# EAGLE design WaldoRevB (EAGLE 7.6.0)
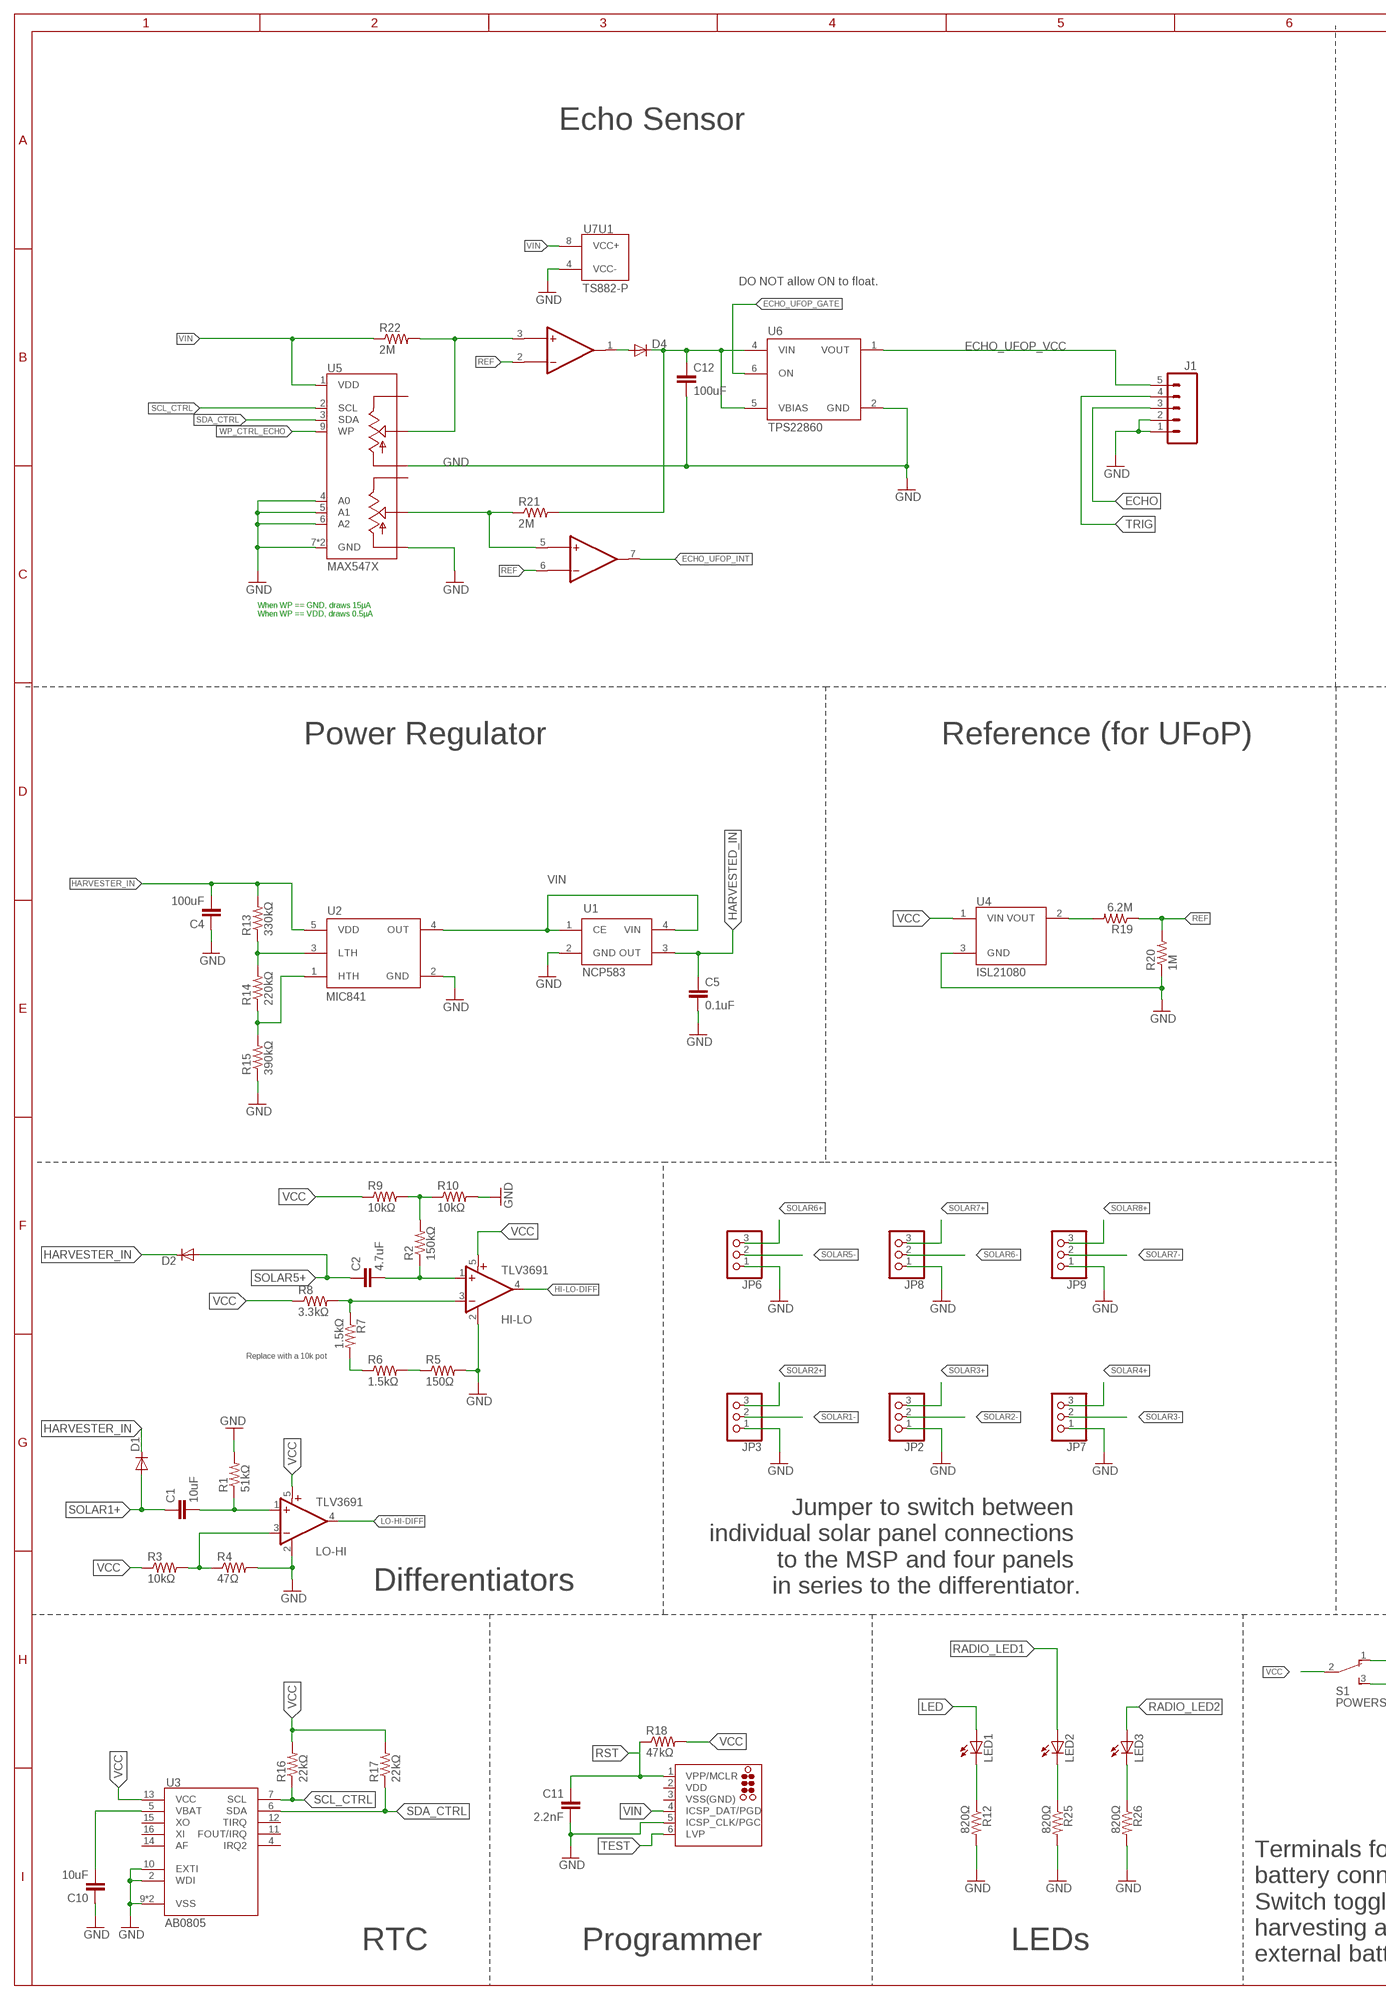
[diagram p0: schematic, sheet 1, part 1 of 2]
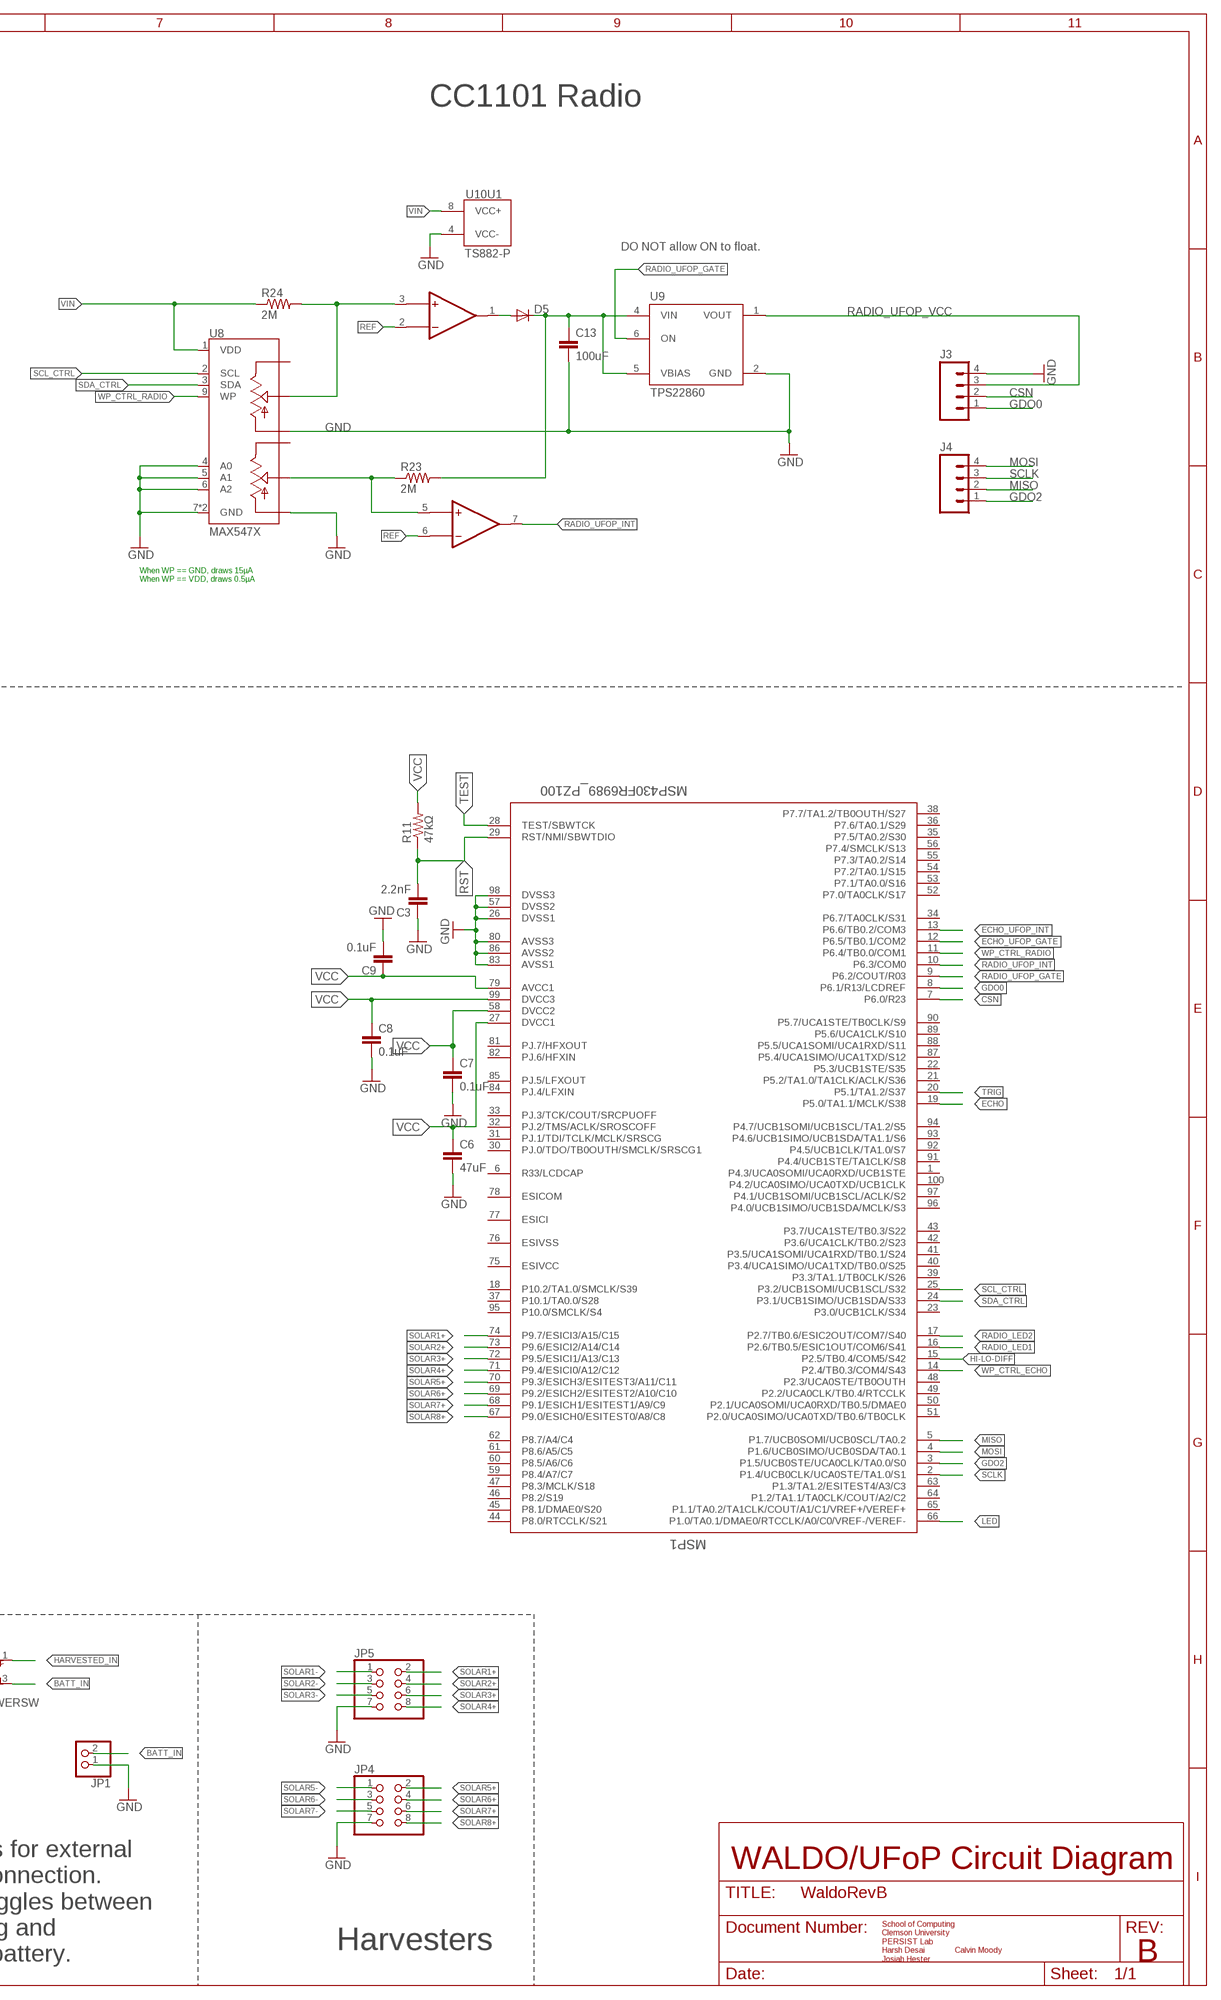
[diagram p1: schematic, sheet 1, part 2 of 2]

## Parts
C1  10uF  CAP0805  [0805]
C2  4.7uF  CAP0805  [0805]
C3  2.2nF  CAP0805  [0805]
C4  100uF  CAP0805  [0805]
C5  0.1uF  CAP0805  [0805]
C6  47uF  CAP0805  [0805]
C7  0.1uF  CAP0805  [0805]
C8  0.1uF  CAP0805  [0805]
C9  0.1uF  CAP0805  [0805]
C10  10uF  CAP0805  [0805]
C11  2.2nF  CAP0805  [0805]
C12  100uF  CAP1210  [1210]
C13  100uF  CAP1210  [1210]
D1  DIODESOD523  [SOD523]
D2  DIODESOD523  [SOD523]
D4  DIODESOD  [SOD-323]
D5  DIODESOD  [SOD-323]
HI-LO  TLV3691  [SC70-5]
J1  M05PTH  [1X05]
J2  TC2030-MCP-NL  [TC2030-MCP-NL]
J3  M04PTH  [1X04]
J4  M04PTH  [1X04]
JP1  PINHD-1X2  [1X02]
JP2  PINHD-1X3  [1X03]
JP3  PINHD-1X3  [1X03]
JP4  PINHD-2X4  [2X04]
JP5  PINHD-2X4  [2X04]
JP6  PINHD-1X3  [1X03]
JP7  PINHD-1X3  [1X03]
JP8  PINHD-1X3  [1X03]
JP9  PINHD-1X3  [1X03]
LED1  LEDCHIP-LED0805  [CHIP-LED0805]
LED2  LEDCHIP-LED0805  [CHIP-LED0805]
LED3  LEDCHIP-LED0805  [CHIP-LED0805]
LO-HI  TLV3691  [SC70-5]
MSP1  MSP430FR6989_PZ100  [PZ100]
R1  51kΩ  R-US_M0805  [M0805]
R2  150kΩ  R-US_M0805  [M0805]
R3  10kΩ  R-US_M0805  [M0805]
R4  47Ω  R-US_M0805  [M0805]
R5  150Ω  R-US_M0805  [M0805]
R6  1.5kΩ  R-US_M0805  [M0805]
R7  1.5kΩ  R-US_M0805  [M0805]
R8  3.3kΩ  R-US_M0805  [M0805]
R9  10kΩ  R-US_M0805  [M0805]
R10  10kΩ  R-US_M0805  [M0805]
R11  47kΩ  R-US_M0805  [M0805]
R12  820Ω  R-US_M0805  [M0805]
R13  330kΩ  R-US_M0805  [M0805]
R14  220kΩ  R-US_M0805  [M0805]
R15  390kΩ  R-US_M0805  [M0805]
R16  22kΩ  R-US_M0805  [M0805]
R17  22kΩ  R-US_M0805  [M0805]
R18  47kΩ  R-US_M0805  [M0805]
R19  6.2M  R-EU0603  [0603]
R20  1M  R-EU0603  [0603]
R21  2M  R-EU0603  [0603]
R22  2M  R-EU0603  [0603]
R23  2M  R-EU0603  [0603]
R24  2M  R-EU0603  [0603]
R25  820Ω  R-US_M0805  [M0805]
R26  820Ω  R-US_M0805  [M0805]
S1  POWERSW  [TL3XYO]
U1  NCP583  [SC82-AB_1PRIMARY]
U2  MIC841  [SC70-5]
U3  AB0805  [QFN16]
U4  ISL21080  [SOT-23]
U5  MAX547X  [QFN16]
U6  TPS22860  [TSOT23-6]
U7  TS882-P  [UDFN8]
U8  MAX547X  [QFN16]
U9  TPS22860  [TSOT23-6]
U10  TS882-P  [UDFN8]

## Nets
BATT_IN: JP1.2 S1.3(S)
CSN: J3.2 MSP1.7(P6.0/R23)
ECHO: J1.3 MSP1.19(P5.0/TA1.1/MCLK/S38)
ECHO_UFOP_GATE: MSP1.12(P6.5/TB0.1/COM2) U6.6(ON)
ECHO_UFOP_INT: MSP1.13(P6.6/TB0.2/COM3) U7.7(OP2:OUT1)
ECHO_UFOP_VCC: J1.5 U6.1(VOUT)
GDO0: J3.1 MSP1.8(P6.1/R13/LCDREF)
GDO2: J4.1 MSP1.3(P1.5/UCB0STE/UCA0CLK/TA0.0/S0)
GND: C3.1 C4.1 C5.2 C6.2 C7.2 C8.2 C9.2 C10.1 C11.2 C12.2 C13.2 HI-LO.2(GND) J1.1 J1.2 J2.5(ICSP_CLK/PGC) J3.4 JP1.1 JP2.1 JP3.1 JP4.7 JP5.7 JP6.1 JP7.1 JP8.1 JP9.1 LO-HI.2(GND) MSP1.26(DVSS1) MSP1.57(DVSS2) MSP1.80(AVSS3) MSP1.83(AVSS1) MSP1.86(AVSS2) MSP1.98(DVSS3) R1.2 R4.2 R5.2 R10.2 R12.2 R15.1 R20.1 R25.2 R26.2 U1.2(GND) U2.2(GND) U3.2(WDI) U3.9(VSS) U3.10(EXTI) U3.TH(VSS) U4.3(GND) U5.4(A0) U5.5(A1) U5.6(A2) U5.7(GND) U5.10(LB) U5.13(LA) U5.TH(GND) U6.2(GND) U7.4(U1:VCC-) U8.4(A0) U8.5(A1) U8.6(A2) U8.7(GND) U8.10(LB) U8.13(LA) U8.TH(GND) U9.2(GND) U10.4(U1:VCC-)
HARVESTED_IN: C5.1 S1.1(O) U1.3(OUT)
HARVESTER_IN: C4.2 D1.C D2.C R13.2 U2.5(VDD)
HI-LO-DIFF: HI-LO.4(OUT) MSP1.15(P2.5/TB0.4/COM5/S42)
LED: LED1.A MSP1.66(P1.0/TA0.1/DMAE0/RTCCLK/A0/C0/VREF-/VEREF-)
LO-HI-DIFF: LO-HI.4(OUT)
MISO: J4.2 MSP1.5(P1.7/UCB0SOMI/UCB0SCL/TA0.2)
MOSI: J4.4 MSP1.4(P1.6/UCB0SIMO/UCB0SDA/TA0.1)
N$1: C1.2 LO-HI.1(+IN) R1.1
N$2: C2.2 HI-LO.1(+IN) R2.1
N$3: LO-HI.3(-IN) R3.2 R4.1
N$4: R5.1 R6.2
N$5: R6.1 R7.2
N$6: HI-LO.3(-IN) R7.1 R8.2
N$7: LED1.C R12.1
N$8: R2.2 R9.2 R10.1
N$9: LED2.C R25.1
N$10: LED3.C R26.1
N$11: R13.1 R14.2 U2.3(LTH)
N$12: R14.1 R15.2 U2.1(HTH)
N$13: C10.2 U3.5(VBAT)
N$14: R19.2 U4.2(VOUT)
N$16: R22.2 U5.14(WA) U7.3(OP1:IN1+)
N$17: C12.1 D4.1(C) R21.2 U6.4(VIN) U6.5(VBIAS)
N$18: R21.1 U5.11(WB) U7.5(OP2:IN1+)
N$20: D4.2(A) U7.1(OP1:OUT1)
N$21: R24.2 U8.14(WA) U10.3(OP1:IN1+)
N$22: C13.1 D5.1(C) R23.2 U9.4(VIN) U9.5(VBIAS)
N$23: R23.1 U8.11(WB) U10.5(OP2:IN1+)
N$24: D5.2(A) U10.1(OP1:OUT1)
RADIO_LED1: LED2.A MSP1.16(P2.6/TB0.5/ESIC1OUT/COM6/S41)
RADIO_LED2: LED3.A MSP1.17(P2.7/TB0.6/ESIC2OUT/COM7/S40)
RADIO_UFOP_GATE: MSP1.9(P6.2/COUT/R03) U9.6(ON)
RADIO_UFOP_INT: MSP1.10(P6.3/COM0) U10.7(OP2:OUT1)
RADIO_UFOP_VCC: J3.3 U9.1(VOUT)
REF: R19.1 R20.2 U7.2(OP1:IN1-) U7.6(OP2:IN1-) U10.2(OP1:IN1-) U10.6(OP2:IN1-)
RST: C3.2 C11.1 J2.1(VPP/MCLR) MSP1.29(RST/NMI/SBWTDIO) R11.1 R18.1
SCL_CTRL: MSP1.25(P3.2/UCB1SOMI/UCB1SCL/S32) R16.1 U3.7(SCL) U5.2(SCL) U8.2(SCL)
SCLK: J4.3 MSP1.2(P1.4/UCB0CLK/UCA0STE/TA1.0/S1)
SDA_CTRL: MSP1.24(P3.1/UCB1SIMO/UCB1SDA/S33) R17.1 U3.6(SDA) U5.3(SDA) U8.3(SDA)
SOLAR1+: C1.1 D1.A JP5.2 MSP1.74(P9.7/ESICI3/A15/C15)
SOLAR1-: JP3.2 JP5.1
SOLAR2+: JP3.3 JP5.4 MSP1.73(P9.6/ESICI2/A14/C14)
SOLAR2-: JP2.2 JP5.3
SOLAR3+: JP2.3 JP5.6 MSP1.72(P9.5/ESICI1/A13/C13)
SOLAR3-: JP5.5 JP7.2
SOLAR4+: JP5.8 JP7.3 MSP1.71(P9.4/ESICI0/A12/C12)
SOLAR5+: C2.1 D2.A JP4.2 MSP1.70(P9.3/ESICH3/ESITEST3/A11/C11)
SOLAR5-: JP4.1 JP6.2
SOLAR6+: JP4.4 JP6.3 MSP1.69(P9.2/ESICH2/ESITEST2/A10/C10)
SOLAR6-: JP4.3 JP8.2
SOLAR7+: JP4.6 JP8.3 MSP1.68(P9.1/ESICH1/ESITEST1/A9/C9)
SOLAR7-: JP4.5 JP9.2
SOLAR8+: JP4.8 JP9.3 MSP1.67(P9.0/ESICH0/ESITEST0/A8/C8)
TEST: J2.6(LVP) MSP1.28(TEST/SBWTCK)
TRIG: J1.4 MSP1.20(P5.1/TA1.2/S37)
VCC: C6.1 C7.1 C8.1 C9.1 HI-LO.5(V+) LO-HI.5(V+) MSP1.27(DVCC1) MSP1.58(DVCC2) MSP1.79(AVCC1) MSP1.99(DVCC3) R3.1 R8.1 R9.1 R11.2 R16.2 R17.2 R18.2 S1.2(P) U3.13(VCC) U4.1(VIN)
VIN: J2.4(ICSP_DAT/PGD) R22.1 R24.1 U1.1(CE) U1.4(VIN) U2.4(OUT) U5.1(VDD) U7.8(U1:VCC+) U8.1(VDD) U10.8(U1:VCC+)
WP_CTRL_ECHO: MSP1.14(P2.4/TB0.3/COM4/S43) U5.9(WP)
WP_CTRL_RADIO: MSP1.11(P6.4/TB0.0/COM1) U8.9(WP)
Unconnected: MSP1.1(P4.3/UCA0SOMI/UCA0RXD/UCB1STE) MSP1.6(R33/LCDCAP) MSP1.18(P10.2/TA1.0/SMCLK/S39) MSP1.21(P5.2/TA1.0/TA1CLK/ACLK/S36) MSP1.22(P5.3/UCB1STE/S35) MSP1.23(P3.0/UCB1CLK/S34) MSP1.30(PJ.0/TDO/TB0OUTH/SMCLK/SRSCG1) MSP1.31(PJ.1/TDI/TCLK/MCLK/SRSCG) MSP1.32(PJ.2/TMS/ACLK/SROSCOFF) MSP1.33(PJ.3/TCK/COUT/SRCPUOFF) MSP1.34(P6.7/TA0CLK/S31) MSP1.35(P7.5/TA0.2/S30) MSP1.36(P7.6/TA0.1/S29) MSP1.37(P10.1/TA0.0/S28) MSP1.38(P7.7/TA1.2/TB0OUTH/S27) MSP1.39(P3.3/TA1.1/TB0CLK/S26) MSP1.40(P3.4/UCA1SIMO/UCA1TXD/TB0.0/S25) MSP1.41(P3.5/UCA1SOMI/UCA1RXD/TB0.1/S24) MSP1.42(P3.6/UCA1CLK/TB0.2/S23) MSP1.43(P3.7/UCA1STE/TB0.3/S22) MSP1.44(P8.0/RTCCLK/S21) MSP1.45(P8.1/DMAE0/S20) MSP1.46(P8.2/S19) MSP1.47(P8.3/MCLK/S18) MSP1.48(P2.3/UCA0STE/TB0OUTH) MSP1.49(P2.2/UCA0CLK/TB0.4/RTCCLK) MSP1.50(P2.1/UCA0SOMI/UCA0RXD/TB0.5/DMAE0) MSP1.51(P2.0/UCA0SIMO/UCA0TXD/TB0.6/TB0CLK) MSP1.52(P7.0/TA0CLK/S17) MSP1.53(P7.1/TA0.0/S16) MSP1.54(P7.2/TA0.1/S15) MSP1.55(P7.3/TA0.2/S14) MSP1.56(P7.4/SMCLK/S13) MSP1.59(P8.4/A7/C7) MSP1.60(P8.5/A6/C6) MSP1.61(P8.6/A5/C5) MSP1.62(P8.7/A4/C4) MSP1.63(P1.3/TA1.2/ESITEST4/A3/C3) MSP1.64(P1.2/TA1.1/TA0CLK/COUT/A2/C2) MSP1.65(P1.1/TA0.2/TA1CLK/COUT/A1/C1/VREF+/VEREF+) MSP1.75(ESIVCC) MSP1.76(ESIVSS) MSP1.77(ESICI) MSP1.78(ESICOM) MSP1.81(PJ.7/HFXOUT) MSP1.82(PJ.6/HFXIN) MSP1.84(PJ.4/LFXIN) MSP1.85(PJ.5/LFXOUT) MSP1.87(P5.4/UCA1SIMO/UCA1TXD/S12) MSP1.88(P5.5/UCA1SOMI/UCA1RXD/S11) MSP1.89(P5.6/UCA1CLK/S10) MSP1.90(P5.7/UCA1STE/TB0CLK/S9) MSP1.91(P4.4/UCB1STE/TA1CLK/S8) MSP1.92(P4.5/UCB1CLK/TA1.0/S7) MSP1.93(P4.6/UCB1SIMO/UCB1SDA/TA1.1/S6) MSP1.94(P4.7/UCB1SOMI/UCB1SCL/TA1.2/S5) MSP1.95(P10.0/SMCLK/S4) MSP1.96(P4.0/UCB1SIMO/UCB1SDA/MCLK/S3) MSP1.97(P4.1/UCB1SOMI/UCB1SCL/ACLK/S2) MSP1.100(P4.2/UCA0SIMO/UCA0TXD/UCB1CLK) U3.4(IRQ2) U3.11(FOUT/IRQ) U3.12(TIRQ) U3.14(AF) U3.15(XO) U3.16(XI) U5.12(HB) U5.15(HA) U8.12(HB) U8.15(HA)

## Notes on the sheet
- CC1101 Radio
- Echo Sensor
- DO NOT allow ON to float.
- DO NOT allow ON to float.
- When WP == GND, draws 15µA
  When WP == VDD, draws 0.5µA
- When WP == GND, draws 15µA
  When WP == VDD, draws 0.5µA
- Power Regulator | Reference (for UFoP)
- Replace with a 10k pot
- Jumper to switch between 
  individual solar panel connections 
  to the MSP and four panels 
  in series to the differentiator.
- Differentiators
- WALDO/UFoP Circuit Diagram
- RTC | Programmer | LEDs | Harvesters
- Terminals for external
  battery connection.
  Switch toggles between
  harvesting and 
  external battery.
- School of Computing
  Clemson University
  PERSIST Lab
  Harsh Desai               Calvin Moody
  Josiah Hester
- B

## Power pins joined to a net without a drawn wire
VDD: J2.2(VDD)
VSS(GND): J2.3(VSS(GND))

## Library data of the parts
C1-C11 = SparkFun-Capacitors:CAP: Capacitor Standard 0603 ceramic capacitor, and 0.1" leaded capacitor.
C12 C13 = SparkFun-Capacitors:CAP: Capacitor Standard 0603 ceramic capacitor, and 0.1" leaded capacitor.; DIGIKEY: 490-9969-1-ND
D1 D2 = SparkFun-DiscreteSemi:DIODE: Diode These are standard reverse protection diodes and small signal diodes. SMA package can handle up to about 1A. SOD-323 can handle about 200mA. What the SOD-323 package when ordering, there are some mfgs out there that are 5-pin packages.
D4 D5 = SparkFun-DiscreteSemi:DIODE: Diode These are standard reverse protection diodes and small signal diodes. SMA package can handle up to about 1A. SOD-323 can handle about 200mA. What the SOD-323 package when ordering, there are some mfgs out there that are 5-pin packages.; PROD_ID: DIO-09646
HI-LO LO-HI = fedpower:TLV3691: 0.9-V to 6.5-V, Nanopower Comparator Datasheets Analog Signal Chain Guide <http://www.ti.com/lit/pdf/slyb174> TLV3691 <http://www.ti.com/lit/ds/symlink/tlv3691.pdf> Manufacturer Product Page TLV3691IDPFR Specifications <http://www.ti.com/general/docs/suppproductinfo.tsp?distId=10&orderablePartNumber=TLV3691IDPFR> Standard Package <javascript:dlgHelp('Standard%20Packaging%20Help');> 1 Category Integrated Circuits (ICs) </product-search/en/integrated-circuits-ics> Family Linear - Comparators </product-search/en/integrated-circuits-ics/linear-comparators/2556221> Series - Packaging <javascript:dlgHelp('Standard%20Packaging%20Help');> Cut Tape (CT) <javascript:dlgHelp('Cut%20Tape%20Help');> Type General Purpose Number of Elements 1 Output Type Push-Pull Voltage - Supply, Single/Dual (±) 0.9 V ~ 6.5 V, ±0.45 V ~ 3.25 V Voltage - Input Offset (Max) 3mV Current - Input Bias (Max) 100pA Current - Output (Typ) 42mA Current - Quiescent (Max) 150nA CMRR, PSRR (Typ) - Propagation Delay (Max) 35µs Hysteresis - Operating Temperature -40°C ~ 125°C Package / Case 6-XFDFN Mounting Type Surface Mount Supplier Device Package 6-X2SON (1x1) Online Catalog Comparators - 1 element </catalog/en/partgroup/comparators-1-element/3112?mpart=TLV3691IDPFR&vendor=296&WT.z_ref_page_type=PS&WT.z_ref_page_sub_type=PD&WT.z_ref_page_id=PD&WT.z_ref_page_event=DC_Link_Table> Other Names 296-37242-1
J1 = SparkFun-Connectors:M05: Header 5 Standard 5-pin 0.1" header. Use with straight break away headers (SKU : PRT-00116), right angle break away headers (PRT-00553), swiss pins (PRT-00743), machine pins (PRT-00117), and female headers (PRT-00115). Molex polarized connector foot print use with SKU : PRT-08230 with associated crimp pins and housings.
J2 = tag-connect_msp430:TC2030: TAG-CONNECT ICSP Connector Manufacturer: Tag-Connect <http://www.tag-connect.com> Cable for easy In-Circuit Serial Programming. Designed for Microchip ICD2, suitable for many others. Two variants - one "with legs" (for hands-free fit on PCB) and another "without legs" for quick programming. PAD Description 1 MCLR/Vpp 2 Vdd 3 GND 4 PGD (ISPDAT) 5 PGC (ISPCLK) 6 nc (used for LVP) ©2009 ROFA.cz - modified and updated by Robert Darlington ‹rdarlington@gmail.com›
J3 J4 = SparkFun-Connectors:M04: Header 4 Standard 4-pin 0.1" header. Use with straight break away headers (SKU : PRT-00116), right angle break away headers (PRT-00553), swiss pins (PRT-00743), machine pins (PRT-00117), and female headers (PRT-00115). Molex polarized connector foot print use with SKU : PRT-08231 with associated crimp pins and housings. 1MM SMD Version SKU: PRT-10208; PROD_ID: CONN-09696
JP1 = pinhead:PINHD-1X2: PIN HEADER
JP2 JP3 JP6-JP9 = pinhead:PINHD-1X3: PIN HEADER
JP4 JP5 = pinhead:PINHD-2X4: PIN HEADER
LED1-LED3 = led:LED: LED OSRAM: - CHIPLED LG R971, LG N971, LY N971, LG Q971, LY Q971, LO R971, LY R971 LH N974, LH R974 LS Q976, LO Q976, LY Q976 LO Q996 - Hyper CHIPLED LW Q18S LB Q993, LB Q99A, LB R99A - SideLED LS A670, LO A670, LY A670, LG A670, LP A670 LB A673, LV A673, LT A673, LW A673 LH A674 LY A675 LS A676, LA A676, LO A676, LY A676, LW A676 LS A679, LY A679, LG A679 - Hyper Micro SIDELED® LS Y876, LA Y876, LO Y876, LY Y876 LT Y87S - SmartLED LW L88C, LW L88S LB L89C, LB L89S, LG L890 LS L89K, LO L89K, LY L89K LS L896, LA L896, LO L896, LY L896 - TOPLED LS T670, LO T670, LY T670, LG T670, LP T670 LSG T670, LSP T670, LSY T670, LOP T670, LYG T670 LG T671, LOG T671, LSG T671 LB T673, LV T673, LT T673, LW T673 LH T674 LS T676, LA T676, LO T676, LY T676, LB T676, LH T676, LSB T676, LW T676 LB T67C, LV T67C, LT T67C, LS T67K, LO T67K, LY T67K, LW E67C LS E67B, LA E67B, LO E67B, LY E67B, LB E67C, LV E67C, LT E67C LW T67C LS T679, LY T679, LG T679 LS T770, LO T770, LY T770, LG T770, LP T770 LB T773, LV T773, LT T773, LW T773 LH T774 LS E675, LA E675, LY E675, LS T675 LS T776, LA T776, LO T776, LY T776, LB T776 LHGB T686 LT T68C, LB T68C - Hyper Mini TOPLED® LB M676 - Mini TOPLED Santana® LG M470 LS M47K, LO M47K, LY M47K Source: http://www.osram.convergy.de LUXEON: - LUMILED® LXK2-PW12-R00, LXK2-PW12-S00, LXK2-PW14-U00, LXK2-PW14-V00 LXK2-PM12-R00, LXK2-PM12-S00, LXK2-PM14-U00 LXK2-PE12-Q00, LXK2-PE12-R00, LXK2-PE12-S00, LXK2-PE14-T00, LXK2-PE14-U00 LXK2-PB12-K00, LXK2-PB12-L00, LXK2-PB12-M00, LXK2-PB14-N00, LXK2-PB14-P00, LXK2-PB14-Q00 LXK2-PR12-L00, LXK2-PR12-M00, LXK2-PR14-Q00, LXK2-PR14-R00 LXK2-PD12-Q00, LXK2-PD12-R00, LXK2-PD12-S00 LXK2-PH12-R00, LXK2-PH12-S00 LXK2-PL12-P00, LXK2-PL12-Q00, LXK2-PL12-R00 Source: www.luxeon.com KINGBRIGHT: KA-3528ASYC Source: www.kingbright.com
MSP1 = msp430:MSP430FR6989_PZ100
R1-R18 R25 R26 = resistor:R-US_: RESISTOR, American symbol
R19 = tiny_passives:R-EU; DIGIKEY: 541-6.20MHCT-ND
R20 = tiny_passives:R-EU; DIGIKEY: 311-1.00MHRCT-ND
R21 R23 = tiny_passives:R-EU; DIGIKEY: 311-2.00MHRCT-ND
R22 R24 = tiny_passives:R-EU
S1 = GreenBoard:POWERSW: TINY SWITCH ON - ON Source: http://www2.produktinfo.conrad.com/datenblaetter/700000-724999/705152-da-01-de-Subminiaturschalter_TL_36YO.pdf
U1 = ncp583:NCP583: NCP583 - Ultra-Low Iq 150 mA CMOS LDO Regulator with Enable The NCP583 series of low dropout regulators are designed for portable battery powered applications which require precise output voltage accuracy and low quiescent current. These devices feature an enable function which lowers current consumption significantly and are offered in two small packages; SC−82AB and the SOT−563. A 1.0 mF ceramic capacitor is the recommended value to be used with these devices on the output pin.
U2 = mic841:MIC841: MIC841:Comparator with reference and adj. hysteresis
U3 = AB08XX:AB0805: AB08X5 Real-Time Clock Family: I2C Version The ABRACON AB08X5 Real-Time Clock family provides a groundbreaking combination of ultra-low power coupled with a highly sophisticated feature set. With power requirements significantly lower than any other industry RTC (as low as 14 nA), these are the first semiconductors based on innovative SPOTTM (Subthreshold Power Optimized Technology) CMOS platform. The AB08X5 includes on-chip oscillators to provide minimum power consumption, full RTC functions including battery backup and programmable counters and alarms for timer and watchdog functions, and either an I2C or SPI serial interface for communication with a host controller.; MOUSER: 815-AB0805-T3
U4 = isl21080:ISL21080: Intersil: ISL21080, 300nA NanoPower Voltage References The ISL21080 analog voltage references feature low supply voltage operation at ultra-low 310nA typ, 1.5µA max operating current. Additionally, the ISL21080 family features guaranteed initial accuracy as low as ±0.2% and 50ppm/°C temperature coefficient. These references are ideal for general purpose portable applications to extend battery life at lower cost. The ISL21080 is provided in the industry standard 3 Ld SOT-23 pinout. The ISL21080 output voltages can be used as precision voltage sources for voltage monitors, control loops, standby voltages for low power states for DSP, FPGA, Datapath Controllers, microcontrollers and other core voltages: 0.9V, 1.024V, 1.25V, 1.5V, 2.048V, 2.5V, 3.0V, 3.3V, 4.096V and 5.0V. Special Note: Post-assembly x-ray inspection may lead to permanent changes in device output voltage and should be minimized or avoided. For further information, please see “Applications Information” on page 14 and AN1533, “X-Ray Effects on Intersil FGA References”.; DIGIKEY: ISL21080DIH309Z-TKCT-ND
U5 U8 = max547x:MAX547X: MAXIM MAX547X: Dual, 256-Tap, Nonvolatile, I2C-Interface, Digital Potentiometers, 400nA Iq, 250µA 12ms write The MAX5477/MAX5478/MAX5479 nonvolatile, dual, linear-taper, digital potentiometers perform the function of a mechanical potentiometer, but replace the mechanics with a simple 2-wire digital interface. Each device performs the same function as a discrete potentiometer or variable resistor and has 256 tap points. The devices feature an internal, nonvolatile EEPROM used to store the wiper position for initialization during power-up. A write-protect feature prevents accidental overwrites of the EEPROM. The fast-mode I2C-compatible serial interface allows communication at data rates up to 400kbps, minimizing board space and reducing interconnection complexity in many applications. Three address inputs allow a total of eight unique address combinations.; DIGIKEY: MAX5479ETE+-ND
U6 U9 = tps22860:TPS22860: TI: TPS22860 Ultra-Low Leakage Load Switch The TPS22860 is a small, ultra-low leakage current, single channel load switch. The device requires a VBIAS voltage and can operate over an input voltage range of 0 V to VBIAS. It can support a maximum continuous current of 200 mA. The switch is controlled by an on/off input (ON), which is capable of interfacing directly with low-voltage control signals. The TPS22860 is available in two small, space-saving 6-pin SOT-23 and SC70 packages. The device is characterized for operation over the free-air temperature range of –40°C to 85°C.; DIGIKEY: 296-43982-1-ND
U7 U10 = ts882:TS882-P; DIGIKEY: 497-14073-1-ND

## Board
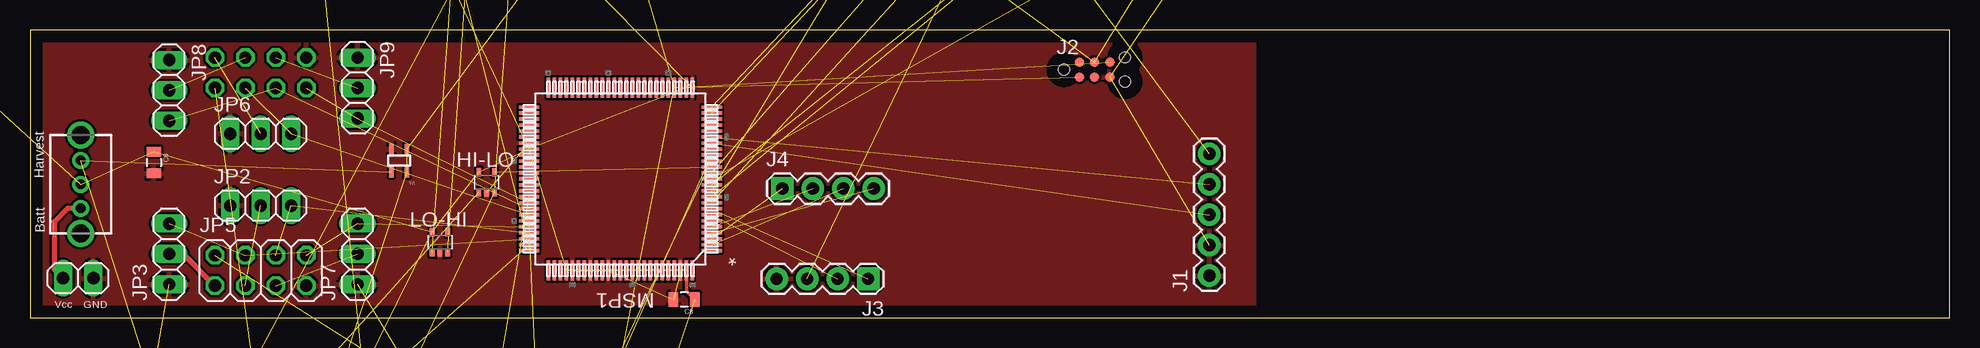
[diagram p2: board, top side]
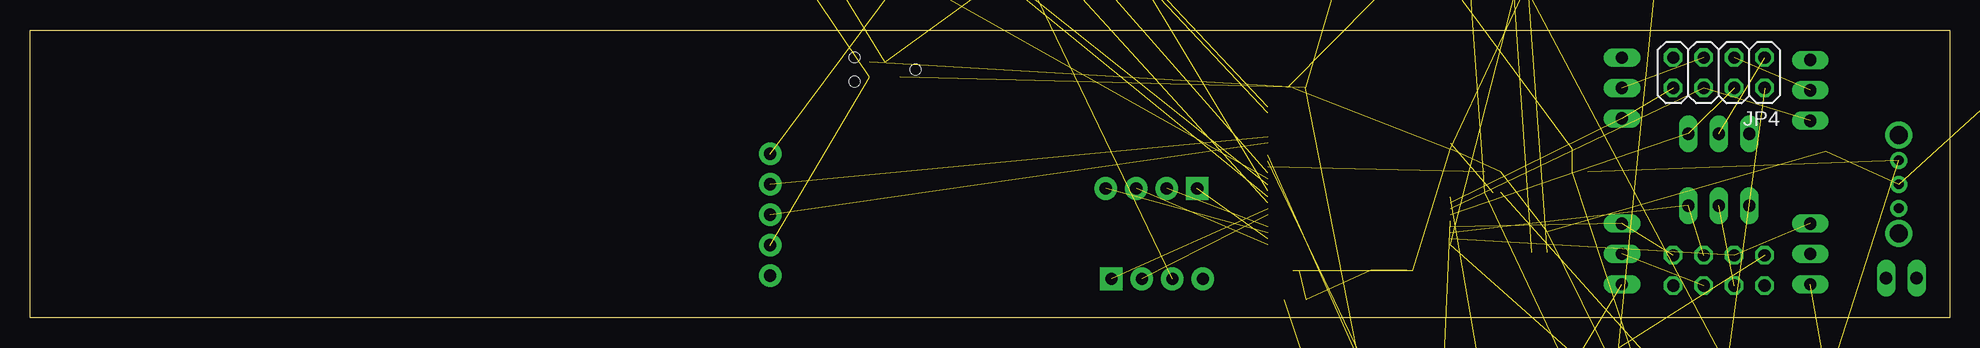
[diagram p3: board, bottom side, seen from below]

Size 160 x 24 mm. Coordinates in mm from the lower left corner, seen from the top.
Outline: 0,0 160,0 160,24 0,24 0,0
Copper layers (1*16): Top 0.035mm / dielectric 1.5mm / Bottom 0.035mm
Design rules "default": minimum track width 10mil, minimum drill 24mil, track to track 8mil, track to pad 8mil, pad to pad 8mil, via to via 8mil, smd to smd 8mil, copper to edge 40mil, drill to drill 8mil, minimum pad ring 10mil, minimum via ring 8mil, stop-mask expansion 4mil, vias tented up to drill 0mil, thermal gap 10mil

### Footprints (pad centres in the part's own frame; a part is rotated, then mirrored left to right if it is on the bottom)
0805 = smd 0.8 x 1.2: 1 -0.9,0; 2 0.9,0
1210 = smd 1.2 x 2: 1 -1.6,0; 2 1.6,0
SOD523 = smd 0.7 x 0.5: A 0.7,0; C -0.6,0
SOD-323 = smd 0.63 x 0.83: 1 -1.15,0; 2 1.15,0
SC70-5 = smd 0.4 x 0.7: 1 -0.65,-0.85; 2 0,-0.85; 3 0.65,-0.85; 4 0.65,0.85; 5 -0.65,0.85
1X05 = drill 1.016 pad 1.88: 1 0,0; 2 2.54,0; 3 5.08,0; 4 7.62,0; 5 10.16,0
TC2030-MCP-NL = smd 0.787 x 0.787: 1 1.27,-0.635; 2 1.27,0.635; 3 2.54,-0.635; 4 2.54,0.635; 5 3.81,-0.635; 6 3.81,0.635 | hole 0.889: 0,0; 5.08,-1.016; 5.08,1.016
1X04 = drill 1.016 pad 1.88 square: 1 0,0 | drill 1.016 pad 1.88: 2 2.54,0; 3 5.08,0; 4 7.62,0
1X02 = drill 1.016 long: 1 -1.27,0; 2 1.27,0
1X03 = drill 1.016 long: 1 -2.54,0; 2 0,0; 3 2.54,0
2X04 = drill 1.016 octagon: 1 -3.81,-1.27; 2 -3.81,1.27; 3 -1.27,-1.27; 4 -1.27,1.27; 5 1.27,-1.27; 6 1.27,1.27; 7 3.81,-1.27; 8 3.81,1.27
CHIP-LED0805 = smd 1.2 x 1.2: A 0,-1.05; C 0,1.05
PZ100 = smd 1.676 x 0.279: 1 -7.62,5.994; 2 -7.62,5.512; 3 -7.62,5.004; 4 -7.62,4.496; 5 -7.62,3.988; 6 -7.62,3.505; 7 -7.62,2.997; 8 -7.62,2.489; 9 -7.62,2.007; 10 -7.62,1.499; 11 -7.62,0.991; 12 -7.62,0.508; 13 -7.62,0; 14 -7.62,-0.508; 15 -7.62,-0.991; 16 -7.62,-1.499; 17 -7.62,-2.007; 18 -7.62,-2.489; 19 -7.62,-2.997; 20 -7.62,-3.505; 21 -7.62,-3.988; 22 -7.62,-4.496; 23 -7.62,-5.004; 24 -7.62,-5.512; 25 -7.62,-5.994; 51 7.62,-5.994; 52 7.62,-5.512; 53 7.62,-5.004; 54 7.62,-4.496; 55 7.62,-3.988; 56 7.62,-3.505; 57 7.62,-2.997; 58 7.62,-2.489; 59 7.62,-2.007; 60 7.62,-1.499; 61 7.62,-0.991; 62 7.62,-0.508; 63 7.62,0; 64 7.62,0.508; 65 7.62,0.991; 66 7.62,1.499; 67 7.62,2.007; 68 7.62,2.489; 69 7.62,2.997; 70 7.62,3.505; 71 7.62,3.988; 72 7.62,4.496; 73 7.62,5.004; 74 7.62,5.512; 75 7.62,5.994 | smd 0.279 x 1.676: 26 -5.994,-7.62; 27 -5.512,-7.62; 28 -5.004,-7.62; 29 -4.496,-7.62; 30 -3.988,-7.62; 31 -3.505,-7.62; 32 -2.997,-7.62; 33 -2.489,-7.62; 34 -2.007,-7.62; 35 -1.499,-7.62; 36 -0.991,-7.62; 37 -0.508,-7.62; 38 0,-7.62; 39 0.508,-7.62; 40 0.991,-7.62; 41 1.499,-7.62; 42 2.007,-7.62; 43 2.489,-7.62; 44 2.997,-7.62; 45 3.505,-7.62; 46 3.988,-7.62; 47 4.496,-7.62; 48 5.004,-7.62; 49 5.512,-7.62; 50 5.994,-7.62; 76 5.994,7.62; 77 5.512,7.62; 78 5.004,7.62; 79 4.496,7.62; 80 3.988,7.62; 81 3.505,7.62; 82 2.997,7.62; 83 2.489,7.62; 84 2.007,7.62; 85 1.499,7.62; 86 0.991,7.62; 87 0.508,7.62; 88 0,7.62; 89 -0.508,7.62; 90 -0.991,7.62; 91 -1.499,7.62; 92 -2.007,7.62; 93 -2.489,7.62; 94 -2.997,7.62; 95 -3.505,7.62; 96 -3.988,7.62; 97 -4.496,7.62; 98 -5.004,7.62; 99 -5.512,7.62; 100 -5.994,7.62
M0805 = smd 1.3 x 1.6: 1 -0.95,0; 2 0.95,0
0603 = smd 0.95 x 0.95: 1 -0.75,0; 2 0.75,0
TL3XYO = drill 0.8 pad 1.422: 1 -2,0; 2 0,0; 3 2,0 | drill 1.5 pad 1.93: M1 -4.1,0; M2 4.1,0
SC82-AB_1PRIMARY = smd 0.406 x 0.914: 1 -1.321,-0.813; 2 -0.025,-0.813; 3 -0.025,1.067; 4 -1.321,1.067
QFN16 = smd 0.95 x 0.3: 1 -1.6,0.75; 2 -1.6,0.25; 3 -1.6,-0.25; 4 -1.6,-0.75; 9 1.6,-0.75; 10 1.6,-0.25; 11 1.6,0.25; 12 1.6,0.75 | smd 0.3 x 0.95: 5 -0.75,-1.6; 6 -0.25,-1.6; 7 0.25,-1.6; 8 0.75,-1.6; 13 0.75,1.6; 14 0.25,1.6; 15 -0.25,1.6; 16 -0.75,1.6 | smd 1.8 x 1.8: TH 0,0
SOT-23 = smd 0.6 x 1.25: 1 -0.95,-1.075; 2 0.95,-1.075; 3 -0.025,1.075
QFN16' = smd 0.85 x 0.3: 1 -1.475,0.75; 2 -1.475,0.25; 3 -1.475,-0.25; 4 -1.475,-0.75; 9 1.475,-0.75; 10 1.475,-0.25; 11 1.475,0.25; 12 1.475,0.75 | smd 0.3 x 0.85: 5 -0.75,-1.475; 6 -0.25,-1.475; 7 0.25,-1.475; 8 0.75,-1.475; 13 0.75,1.475; 14 0.25,1.475; 15 -0.25,1.475; 16 -0.75,1.475 | smd 1.7 x 1.7: TH 0,0
TSOT23-6 = smd 0.62 x 1.22: 1 -0.95,-1.3; 2 0,-1.3; 3 0.95,-1.3; 4 0.95,1.3; 5 0,1.3; 6 -0.95,1.3
UDFN8 = smd 0.3 x 0.85: 1 -0.75,-1.075; 2 -0.25,-1.075; 3 0.25,-1.075; 4 0.75,-1.075; 5 0.75,1.075; 6 0.25,1.075; 7 -0.25,1.075; 8 -0.75,1.075 | smd 1.6 x 0.45: TH 0,0

### Placement (x,y rotation side)
C1  34.82,36.04 0 top  (outside the outline)
C2  20.01,-7.96 0 top  (outside the outline)
C3  -20.2,57.96 180 top  (outside the outline)
C4  31.39,-9.96 0 top  (outside the outline)
C5  10.42,-9.04 180 top  (outside the outline)
C6  10.33,12.94 270 top
C7  7.96,-12.96 0 top  (outside the outline)
C8  54.53,1.5 180 top
C9  -21.24,35.12 0 top  (outside the outline)
C10  11.95,46.12 0 top  (outside the outline)
C11  -15.86,41.12 0 top  (outside the outline)
C12  63.15,45.06 90 top  (outside the outline)
C13  67.15,44.98 90 top  (outside the outline)
D1  29.42,-4.15 0 top  (outside the outline)
D2  42.03,-17.34 0 top  (outside the outline)
D4  67.15,38.9 90 top  (outside the outline)
D5  63.15,39.09 90 top  (outside the outline)
HI-LO  38.06,11.29 0 top
J1  98.31,3.5 90 top
J2  86.2,20.69 0 top
J3  69.86,3.23 180 top
J4  62.71,10.77 0 top
JP1  4.02,3.29 180 top
JP2  19.22,9.34 0 top
JP3  11.6,5.3 90 top
JP4  19.22,20.43 180 bottom
JP5  19.22,3.93 0 top
JP6  19.22,15.34 0 top
JP7  27.3,5.3 90 top
JP8  11.6,18.96 270 top
JP9  27.3,19.16 270 top
LED1  35.69,-30.52 270 top  (outside the outline)
LED2  35.69,-33.44 270 top  (outside the outline)
LED3  35.69,-36.36 270 top  (outside the outline)
LO-HI  34.17,6.29 0 top
MSP1  49.21,11.57 180 top
R1  9.42,38.91 0 top  (outside the outline)
R2  13.93,-10.71 0 top  (outside the outline)
R3  35.49,29.26 0 top  (outside the outline)
R4  43.31,30.26 0 top  (outside the outline)
R5  2.82,-17.09 0 top  (outside the outline)
R6  9.87,-24.09 0 top  (outside the outline)
R7  22.52,-26.09 0 top  (outside the outline)
R8  40.17,43.91 0 top  (outside the outline)
R9  27.14,-7.74 0 top  (outside the outline)
R10  23.79,44.26 0 top  (outside the outline)
R11  46.44,-22.74 0 top  (outside the outline)
R12  40.38,-30.56 0 top  (outside the outline)
R13  29.58,-20.71 0 top  (outside the outline)
R14  45.23,-8.71 0 top  (outside the outline)
R15  34.22,-7.09 0 top  (outside the outline)
R16  37.09,53.26 0 top  (outside the outline)
R17  -5.26,54.26 0 top  (outside the outline)
R18  46.39,47.26 0 top  (outside the outline)
R19  11.28,-19.15 0 top  (outside the outline)
R20  39.47,36.85 0 top  (outside the outline)
R21  58.25,44.45 90 top  (outside the outline)
R22  60.04,44.37 90 top  (outside the outline)
R23  56.2,44.52 90 top  (outside the outline)
R24  54.45,44.48 270 top  (outside the outline)
R25  40.26,-33.42 0 top  (outside the outline)
R26  40.3,-36.39 0 top  (outside the outline)
S1  4.23,11.12 270 top
U1  30.1,13.23 180 top
U2  22.55,-13.71 0 top  (outside the outline)
U3  58.33,61.67 0 top  (outside the outline)
U4  22.68,-19.98 0 top  (outside the outline)
U5  MAX547X  [QFN16']  73.04,33.08 0 top  (outside the outline)
U6  84.4,33.15 270 top  (outside the outline)
U7  97.42,33.26 0 top  (outside the outline)
U8  MAX547X  [QFN16']  72.95,40.67 0 top  (outside the outline)
U9  84.4,40.5 270 top  (outside the outline)
U10  96.95,41.61 0 top  (outside the outline)

### Tracks (layer width: path | path; a pad name or v marks a point on that pad's centre or on a via)
BATT_IN
  Top 0.406: S1.3 3.12,9.12 2,8 2,4.04 JP1.2
CSN  (1 unrouted)
ECHO  (1 unrouted)
ECHO_UFOP_GATE  (1 unrouted)
ECHO_UFOP_INT  (1 unrouted)
ECHO_UFOP_VCC  (1 unrouted)
GDO0  (1 unrouted)
GDO2  (1 unrouted)
GND  (48 unrouted)
  pour Top: -1,26 -1,-1 102,-1 102,26
HARVESTED_IN  (2 unrouted)
HARVESTER_IN  (4 unrouted)
HI-LO-DIFF  (1 unrouted)
LED  (1 unrouted)
MISO  (1 unrouted)
MOSI  (1 unrouted)
N$1  (2 unrouted)
N$2  (2 unrouted)
N$3  (2 unrouted)
N$4  (1 unrouted)
N$5  (1 unrouted)
N$6  (2 unrouted)
N$7  (1 unrouted)
N$8  (2 unrouted)
N$9  (1 unrouted)
N$10  (1 unrouted)
N$11  (2 unrouted)
N$12  (2 unrouted)
N$13  (1 unrouted)
N$14  (1 unrouted)
N$16  (2 unrouted)
N$17  (4 unrouted)
N$18  (2 unrouted)
N$20  (1 unrouted)
N$21  (2 unrouted)
N$22  (4 unrouted)
N$23  (2 unrouted)
N$24  (1 unrouted)
RADIO_LED1  (1 unrouted)
RADIO_LED2  (1 unrouted)
RADIO_UFOP_GATE  (1 unrouted)
RADIO_UFOP_INT  (1 unrouted)
RADIO_UFOP_VCC  (1 unrouted)
REF  (5 unrouted)
RST  (5 unrouted)
SCL_CTRL  (4 unrouted)
SCLK  (1 unrouted)
SDA_CTRL  (4 unrouted)
SOLAR1+  (3 unrouted)
SOLAR1-
  Top 0.406: JP3.2 12.77,5.3 JP5.1
SOLAR2+  (2 unrouted)
SOLAR2-  (1 unrouted)
SOLAR3+  (2 unrouted)
SOLAR3-  (1 unrouted)
SOLAR4+  (2 unrouted)
SOLAR5+  (3 unrouted)
SOLAR5-  (1 unrouted)
SOLAR6+  (2 unrouted)
SOLAR6-  (1 unrouted)
SOLAR7+  (2 unrouted)
SOLAR7-  (1 unrouted)
SOLAR8+  (2 unrouted)
TEST  (1 unrouted)
TRIG  (1 unrouted)
VCC  (18 unrouted)
  Top 0.305: MSP1.99 54.72,2.21 C8.1
VIN  (9 unrouted)
WP_CTRL_ECHO  (1 unrouted)
WP_CTRL_RADIO  (1 unrouted)

### Text on the board
tPlace: Harvest | Batt | Vcc | GND